# EAGLE design Memory (EAGLE 6.3)
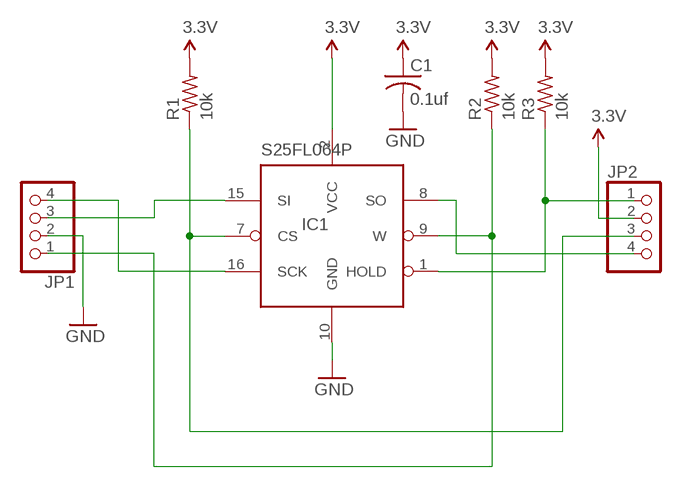
[diagram p0: schematic, sheet 1]

## Parts
C1  0.1uf  CAP0603  [0603_CAP]
IC1  S25FL064P  [SOIC-16]
JP1  PINHD-1X4  [1X04]
JP2  PINHD-1X4  [1X04]
R1  10k  RESISTOR0603  [0603_RESISTOR]
R2  10k  RESISTOR0603  [0603_RESISTOR]
R3  10k  RESISTOR0603  [0603_RESISTOR]

## Nets
3.3V: C1.1 IC1.2(VCC) JP2.2 R1.2 R2.2 R3.2
GND: C1.2 IC1.10(GND) JP1.2
N$1: IC1.7(CS) JP2.3 R1.1
N$2: IC1.9(W) JP1.1 R2.1
N$3: IC1.1(HOLD) JP2.1 R3.1
N$4: IC1.8(SO) JP2.4
N$5: IC1.15(SI) JP1.3
N$6: IC1.16(SCK) JP1.4

## Library data of the parts
C1 = jkf:CAP
IC1 = jkf:S25FL064P: 64MBit SPI Memory
JP1 JP2 = pinhead:PINHD-1X4: PIN HEADER
R1-R3 = jkf:RESISTOR

## Board
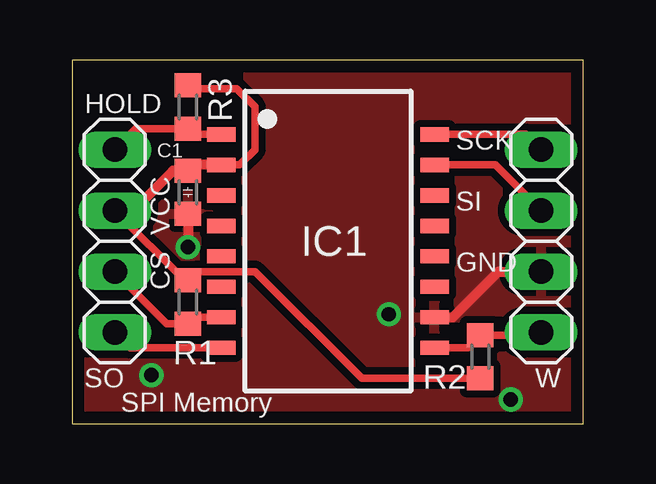
[diagram p1: board, top side]
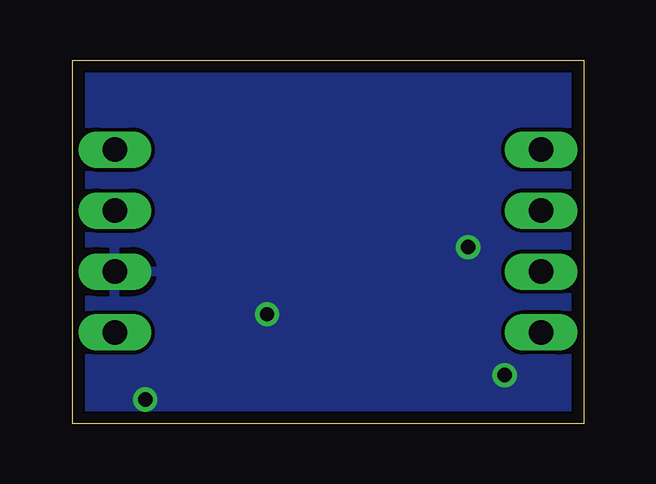
[diagram p2: board, bottom side, seen from below]

Size 21.32 x 15.16 mm. Coordinates in mm from the lower left corner, seen from the top.
Outline: 0,0 21.32,0 21.32,15.16 0,15.16 0,0
Copper layers (1*16): Top 0.0178mm / dielectric 59mil / Bottom 0.0178mm
Design rules "SSC-EAGLE-2Lyr_v1.0.0.3": minimum track width 6mil, minimum drill 14mil, track to track 6mil, track to pad 6mil, pad to pad 6mil, via to via 6mil, smd to smd 6mil, copper to edge 20mil, drill to drill 16mil, minimum pad ring 8mil, minimum via ring 8mil, stop-mask expansion 3mil, vias tented up to drill 0mil, thermal gap 10mil

### Footprints (pad centres in the part's own frame; a part is rotated, then mirrored left to right if it is on the bottom)
0603_CAP = smd 1 x 1.1: 1 -0.9,0; 2 0.9,0
SOIC-16 = smd 1.2 x 0.6: 1 -4.445,4.445; 2 -4.445,3.175; 3 -4.445,1.905; 4 -4.445,0.635; 5 -4.445,-0.635; 6 -4.445,-1.905; 7 -4.445,-3.175; 8 -4.445,-4.445; 9 4.445,-4.445; 10 4.445,-3.175; 11 4.445,-1.905; 12 4.445,-0.635; 13 4.445,0.635; 14 4.445,1.905; 15 4.445,3.175; 16 4.445,4.445
1X04 = drill 1.016 long: 1 -3.81,0; 2 -1.27,0; 3 1.27,0; 4 3.81,0
0603_RESISTOR = smd 1 x 1.1: 1 -0.9,0; 2 0.9,0

### Placement (x,y rotation side)
C1  4.83,9.65 270 top
IC1  10.67,7.62 0 top
JP1  19.56,7.62 90 top
JP2  1.78,7.62 270 top
R1  4.83,5.08 90 top
R2  17.02,2.79 270 top
R3  4.83,13.21 90 top

### Tracks (layer width: path | path; a pad name or v marks a point on that pad's centre or on a via)
3.3V
  Top 0.305: IC1.2 6.99,10.79 7.62,11.43 7.62,13.21 6.86,13.97 4.96,13.97 R3.2 | JP2.2 4.69,5.98 R1.2 5.2,6.35 7.62,6.35 12.08,1.89 R2.2
  Top 0.406: IC1.2 5.07,10.79 C1.1 4.2,10.55 2.54,8.89 JP2.2
GND  (via drill 0.6)
  Top 0.406: C1.2 v4.83,7.37 | IC1.10 15.88,4.45 17.78,6.35 JP1.2
  other vias: 3.3,2.03 18.29,1.02 13.21,4.57
  pour Bottom: 0,15.24 21.59,15.24 21.59,0 0,0
  pour Top (isolate 0.305): 0,15.24 21.59,15.24 21.59,0 0,0
N$1
  Top 0.305: IC1.7 5.09,4.45 R1.1 3.95,4.18 JP2.3
N$2
  Top 0.305: IC1.9 16.5,3.17 R2.1 19.44,3.69 JP1.1
N$3
  Top 0.305: IC1.1 5.07,12.06 R3.1 2.66,12.31 JP2.1
N$4
  Top 0.305: IC1.8 2.41,3.17 JP2.4
N$5
  Top 0.305: IC1.15 17.65,10.79 JP1.3
N$6
  Top 0.305: IC1.16 18.92,12.06 JP1.4

### Text on the board
tSilk: HOLD | SCK | SI | VCC | CS | GND | SO | W | SPI Memory